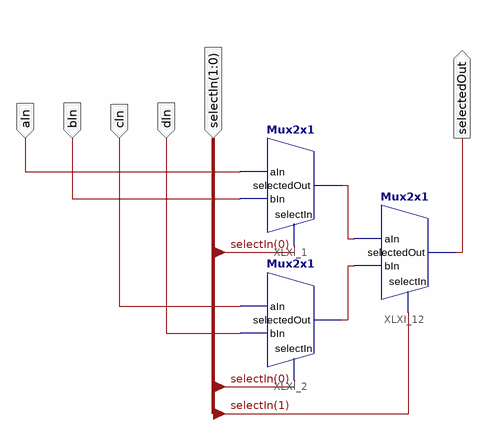
[diagram p0: schematic sheet 1]
// Xilinx ISE schematic Mux4x1.sch (spartan3e) as structural Verilog: 3 symbols, 6 ports
module Mux4x1 (
  input  aIn,
  input  bIn,
  input  cIn,
  input  dIn,
  input  [1:0] selectIn,
  output selectedOut
);

  wire XLXN_35, XLXN_36;

  Mux2x1 XLXI_1 (.aIn(aIn), .bIn(bIn), .selectIn(selectIn[0]), .selectedOut(XLXN_36));
  Mux2x1 XLXI_2 (.aIn(cIn), .bIn(dIn), .selectIn(selectIn[0]), .selectedOut(XLXN_35));
  Mux2x1 XLXI_12 (.aIn(XLXN_36), .bIn(XLXN_35), .selectIn(selectIn[1]), .selectedOut(selectedOut));
endmodule
